# Altium schematic sheet IO.SchDoc: LVDS & RS232C
size 420 x 297 mm; Author: G.Kasprowicz; CompanyName: WUT ISE; DrawnBy: G.Kasprowicz; Organization: WUT ISE; Address1: PW ISE; Address2: Nowowiejska 15/19 00-665 Warsaw; Address3: gkasprow@gmail.com; DocumentNumber: 6; Revision: 2; SheetNumber: 6; SheetTotal: 18; ModifiedBy: -; CheckedDate: -; Title2: PHY & connectors; DivGrp: WUT ISE; Designer: G.Kasprowicz; ModifiedDate: -; ProjectName: Sensor Box
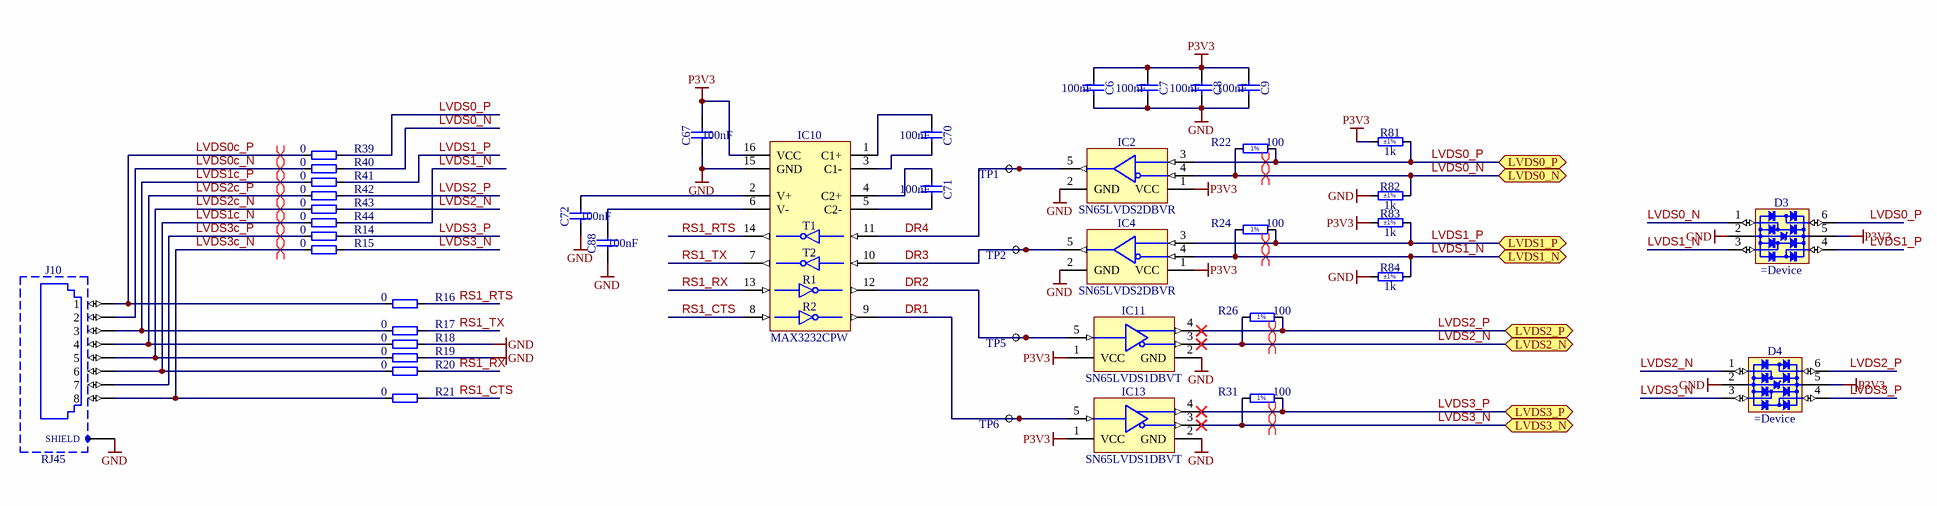
[diagram p0: IO.SchDoc]

## Parts
C6  100nF  [CAPC1005X55N]
C7  100nF  [CAPC1005X55N]
C8  100nF  [CAPC1005X55N]
C9  100nF  [CAPC1005X55N]
C67  100nF  [CAPC1005X55N]
C70  100nF  [CAPC1005X55N]
C71  100nF  [CAPC1005X55N]
C72  100nF  [CAPC1005X55N]
C88  100nF  [CAPC1005X55N]
D3  (no value)  [SOTFL50P160X60-6N]
D4  (no value)  [SOTFL50P160X60-6N]
IC2  SN65LVDS2DBVR  [SOT95P280X145-5N]
IC4  SN65LVDS2DBVR  [SOT95P280X145-5N]
IC10  MAX3232CPW  [SOP65P640X120-16N]
IC11  SN65LVDS1DBVT  [SOT95P280X145-5N]
IC13  SN65LVDS1DBVT  [SOT95P280X145-5N]
J10  RJ45  [FCI_95678-001LF]
R14  0  [RESC1005X40N]
R15  0  [RESC1005X40N]
R16  0  [RESC1005X40N]
R17  0  [RESC1005X40N]
R18  0  [RESC1005X40N]
R19  0  [RESC1005X40N]
R20  0  [RESC1005X40N]
R21  0  [RESC1005X40N]
R22  100  [RESC1005X40N]
R24  100  [RESC1005X40N]
R26  100  [RESC1005X40N]
R31  100  [RESC1005X40N]
R39  0  [RESC1005X40N]
R40  0  [RESC1005X40N]
R41  0  [RESC1005X40N]
R42  0  [RESC1005X40N]
R43  0  [RESC1005X40N]
R44  0  [RESC1005X40N]
R81  1k  Tolerance: ±1%  [RESC1005X40N]
R82  1k  Tolerance: ±1%  [RESC1005X40N]
R83  1k  Tolerance: ±1%  [RESC1005X40N]
R84  1k  Tolerance: ±1%  [RESC1005X40N]
TP1  TP  [TP]  (value not drawn)
TP2  TP  [TP]  (value not drawn)
TP5  TP  [TP]  (value not drawn)
TP6  TP  [TP]  (value not drawn)

## Ports
LVDS0_N (bidir), LVDS0_P (bidir), LVDS1_N (bidir), LVDS1_P (bidir), LVDS2_N (bidir), LVDS2_P (bidir), LVDS3_N (bidir), LVDS3_P (bidir)

## Nets
GND: C6.1 C7.1 C8.1 C9.1 C67.1 C72.2 C88.2 D3.2(GND) D4.2(GND) IC2.2(GND) IC4.2(GND) IC10.15(GND) IC11.2(GND) IC13.2(GND) J10.SHIELD R18.2 R19.2 R82.1 R84.1
P3V3: C6.2 C7.2 C8.2 C9.2 C67.2 D3.5(VBUS) D4.5(VBUS) IC2.1(VCC) IC4.1(VCC) IC10.16(VCC) IC11.1(VCC) IC13.1(VCC) R81.1 R83.1
DR1: IC10.9(R2OUT) IC13.5(R) TP6.1
DR2: IC10.12(R1OUT) IC11.5(R) TP5.1
DR3: IC4.5(R) IC10.10(T2IN) TP2.1
DR4: IC2.5(R) IC10.11(T1IN) TP1.1
LVDS0_N: D3.1(I/O1) IC2.4(B) R22.1 R40.2 R82.2 ; port LVDS0_N
LVDS0_P: D3.6(I/O4) IC2.3(A) R22.2 R39.2 R81.2 ; port LVDS0_P
LVDS0c_N: J10.2 R40.1
LVDS0c_P: J10.1 R16.1 R39.1
LVDS1_N: D3.3(I/O2) IC4.4(B) R24.1 R44.2 R84.2 ; port LVDS1_N
LVDS1_P: D3.4(I/O3) IC4.3(A) R24.2 R41.2 R83.2 ; port LVDS1_P
LVDS1c_N: J10.6 R20.1 R44.1
LVDS1c_P: J10.3 R17.1 R41.1
LVDS2_N: D4.1(I/O1) IC11.3(A) R26.1 R43.2 ; port LVDS2_N
LVDS2_P: D4.6(I/O4) IC11.4(B) R26.2 R42.2 ; port LVDS2_P
LVDS2c_N: J10.5 R19.1 R43.1
LVDS2c_P: J10.4 R18.1 R42.1
LVDS3_N: D4.3(I/O2) IC13.3(A) R15.2 R31.1 ; port LVDS3_N
LVDS3_P: D4.4(I/O3) IC13.4(B) R14.2 R31.2 ; port LVDS3_P
LVDS3c_N: J10.8 R15.1 R21.1
LVDS3c_P: J10.7 R14.1
RS1_CTS: IC10.8(R2IN) R21.2
RS1_RTS: IC10.14(T1OUT) R16.2
RS1_RX: IC10.13(R1IN) R20.2
RS1_TX: IC10.7(T2OUT) R17.2
NetC70_1: C70.1 IC10.3(C1-)
NetC70_2: C70.2 IC10.1(C1+)
NetC71_1: C71.1 IC10.5(C2-)
NetC71_2: C71.2 IC10.4(C2+)
NetC72_1: C72.1 IC10.2(V+)
NetC88_1: C88.1 IC10.6(V-)

## Layout directives
differential pair: LVDS0_N, LVDS0_P, LVDS0c_N, LVDS0c_P, LVDS1_N, LVDS1_P, LVDS1c_N, LVDS1c_P, LVDS2_N, LVDS2_P, LVDS2c_N, LVDS2c_P, LVDS3_N, LVDS3_P, LVDS3c_N, LVDS3c_P

## Notes on the sheet
- Project/Equipment
- Document
- Designer
- Drawn by
- Check.by
- Copyright WUT ISE 2020.
  This documentation describes Open Hardware and is licensed under the CERN OHL v.1.2. You may redistribute and modify this documentation under the terms of the CERN OHL v.1.2. (http://ohwr.org/CERNOHL). This documentation is distributed WITHOUT ANY EXPRESS OR IMPLIED WARRANTY, INCLUDING OF MERCHANTABILITY, SATISFACTORY QUALITY AND FITNESS FOR A PARTICULAR PURPOSE. Please see the CERN OHL v.1.2 for applicable conditions.
- Contact
- File
- Last Mod.
- Print Date
- Sheet
- Size
- A3
- of
- Rev
- (in symbol MAX3232CPW) T1; T2; R1; R2
- (in symbol R0402_100R_1%_0.0625W_100PPM) 1%

## Library data of the parts
C6-C9 C67 C70-C72 C88 = CC0402_100NF_16V_10%_X5R: Non-polarised capacitor; Part Description: SMD Multilayer Chip Ceramic Capacitor; Manufacturer: GENERIC; Manufacturer1 Part Number: GRM155R61C104KA88D; Voltage: 16V; TC: X5R; Tolerance: ±10%; Part Number: CC0402_100NF_16V_10%_X5R; Component Kind: Standard; Component Type: Standard; Pin Count: 2; Value: 100nF; Status: None; Manufacturer Part Number: CC0402_100NF_16V_10%_X5R; Case: 0402; Mounted: Yes; Socket: No; SMD: Yes; Manufacturer1 Example: MURATA; Manufacturer1 ComponentHeight: 0.55mm; HelpURL: \\cern.ch\dfs\Applications\Altium\Datasheets\CC0402_X5R_MURATA_GRM.pdf; Author: CERN DEM JLC; CreateDate: 10.12.2013; LatestRevisionDate: 10.12.2013; Sense: No
D3 D4 = NUP4114UPXV6T1G: Part Number: NUP4114UPXV6T1G
IC2 IC4 = SN65LVDS2DBVR: High-Speed Differential Line Receiver; Manufacturer: TEXAS INSTRUMENTS; PressFit: No; Bonding: No; Part Number: SN65LVDS2DBVR; Component Kind: Standard; Component Type: Standard; Device: SN65LVDS2DBVR; PackageDescription: SOT, 0.95mm pitch; 5 pin, 1.60mm W X 2.90mm L X 1.45mm H body, IPC Medium Density; Part Description: High-Speed Differential Line Receiver; Manufacturer Part Number: SN65LVDS2DBVR; Pin Count: 5; Case: SOT23-5; Mounted: Yes; Socket: No; SMD: Yes; Sense: No; ComponentHeight: 1.45mm; Author: CERN DEM JLC; HelpURL: \\cern.ch\dfs\Applications\Altium\Datasheets\SN65LVDS2DBVR.pdf; CreateDate: 03.03.2011; LatestRevisionDate: 22.09.2011
IC10 = MAX3232CPW: 3-V To 5.5-V Multichannel RS-232 Line Driver/Receiver With ±15kV IEC ESD Protection; Part Description: 3V To 5.5V Multichannel RS-232 Line Driver/Receiver With ±15kV IEC ESD Protection; Manufacturer: TEXAS INSTRUMENTS; Table: Analog & Interface; Part Number: MAX3232CPW; Component Kind: Standard; Component Type: Standard; Device: MAX3232CPW; PackageDescription: SOP, 0.65mm pitch; 16 pin, 4.40mm W X 5.00mm L X 1.20mm H body IPC Medium Density; Manufacturer Part Number: MAX3232CPW; Pin Count: 16; Case: TSSOP16; Mounted: Yes; Socket: No; SMD: Yes; ComponentHeight: 1.2mm; Author: CERN DEM JLC; HelpURL: \\cern.ch\dfs\Applications\Altium\Datasheets\MAX3232CPW.pdf; CreateDate: 2012-01-09; LatestRevisionDate: 2012-01-10
IC11 IC13 = SN65LVDS1DBVT: High-Speed Differential Line Driver; Manufacturer: TEXAS INSTRUMENTS; PressFit: No; Bonding: No; Part Number: SN65LVDS1DBVT; Component Kind: Standard; Component Type: Standard; Device: SN65LVDS1DBVT; PackageDescription: SOT, 0.95mm pitch; 5 pin, 1.60mm W X 2.90mm L X 1.45mm H body, IPC Medium Density; Part Description: High-Speed Differential Line Driver; Manufacturer Part Number: SN65LVDS1DBVT; Pin Count: 5; Case: SOT23-5; Mounted: Yes; Socket: No; SMD: Yes; Sense: No; ComponentHeight: 1.45mm; Author: CERN DEM JLC; HelpURL: \\cern.ch\dfs\Applications\Altium\Datasheets\SN65LVDS1DBVT.pdf; CreateDate: 22.09.2011; LatestRevisionDate: 22.09.2011
J10 = FCI_95678-001LF: 1 Port, 8 Positions Shielded Snap PEG, CAT5 RJ45 Horizontal Modular Jack; Manufacturer: FCI; PressFit: No; Part Number: FCI_95678-001LF; Component Kind: Standard; Component Type: Standard; Pin Count: 10; Family: RJ45; Mounted: Yes; Socket: No; SMD: No; Sense: No; Status: None; Part Description: 1 Port, 8 Positions Shielded Snap PEG, CAT5 RJ45 Horizontal Modular Jack; Manufacturer Part Number: 95678-001LF; ComponentHeight: 13.99mm; HelpURL: \\cern.ch\dfs\Applications\Altium\Datasheets\FCI_95678-001LF.pdf; Author: CERN DEM BC; CreateDate: 28.07.2015; LatestRevisionDate: 28.07.2015
R14-R21 R39-R44 = R0402_0R_JUMPER: Resistor; Part Description: 1A (0.05R Max DC Resistance) Zero Ohm Jumper; Manufacturer: GENERIC; Manufacturer1 Part Number: 232270591001L; Table: Resistors SMD; Part Number: R0402_0R_JUMPER; Component Kind: Standard; Component Type: Standard; Pin Count: 2; Value: 0; Status: Not recommended; Manufacturer Part Number: R0402_0R_JUMPER; Case: 0402; Mounted: Yes; Socket: No; SMD: Yes; Manufacturer1 Example: YAGEO PHYCOMP; Manufacturer1 ComponentHeight: 0.4mm; HelpURL: \\cern.ch\dfs\Applications\Altium\Datasheets\R0402_Phycomp_RC0402.pdf; Author: CERN DEM JLC; CreateDate: 2007-12-03; LatestRevisionDate: 2012-10-17
R22 R24 R26 R31 = R0402_100R_1%_0.0625W_100PPM: Resistor - 1%; Part Description: General Purpose Thick Film Chip Resistor; Manufacturer: GENERIC; Manufacturer1 Part Number: 232270671001L; TC: ±100ppm/°C; Table: Resistors SMD; Part Number: R0402_100R_1%_0.0625W_100PPM; Component Kind: Standard; Component Type: Standard; Pin Count: 2; Value: 100; Status: Not recommended; Power: 0.0625W; Tolerance: ±1%; Manufacturer Part Number: R0402_100R_1%_0.0625W_100PPM; Case: 0402; Mounted: Yes; Socket: No; SMD: Yes; Manufacturer1 Example: YAGEO PHYCOMP; Manufacturer1 ComponentHeight: 0.4mm; HelpURL: \\cern.ch\dfs\Applications\Altium\Datasheets\R0402_Phycomp_RC0402.pdf; Author: CERN DEM JLC; CreateDate: 2007-12-03; LatestRevisionDate: 2012-10-17
R81-R84 = R0402_1K_1%_0.0625W_100PPM: Resistor - 1%; Part Description: General Purpose Thick Film Chip Resistor; Manufacturer: GENERIC; Manufacturer1 Part Number: 232270671002L; TC: ±100ppm/°C; PressFit: No; Part Number: R0402_1K_1%_0.0625W_100PPM; Component Kind: Standard; Component Type: Standard; Pin Count: 2; Value: 1k; Status: Not Recommended; Power: 0.0625W; Manufacturer Part Number: R0402_1K_1%_0.0625W_100PPM; Case: 0402; Mounted: Yes; Sense: No; Socket: No; SMD: Yes; Manufacturer1 Example: YAGEO PHYCOMP; Manufacturer1 ComponentHeight: 0.4mm; HelpURL: \\cern.ch\dfs\Applications\Altium\Datasheets\R0402_Phycomp_RC0402.pdf; Author: CERN DEM JLC; CreateDate: 03.12.2007; LatestRevisionDate: 17.10.2012
TP1 TP2 TP5 TP6 = TP: Testpoint